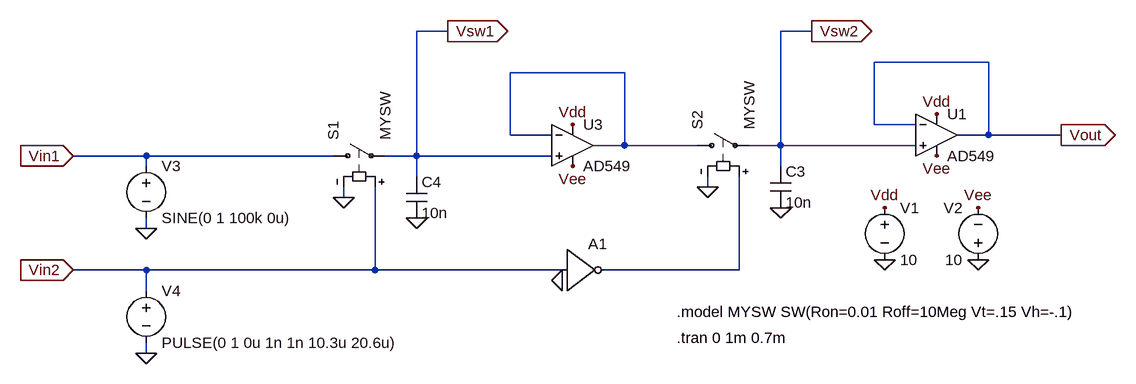
[diagram p0: schematic Sampling Phase Detector.asc]
Sampling Phase Detector.asc, the LTspice schematic file:
Version 4
SHEET 1 1824 776
WIRE -576 -80 -624 -80
WIRE -16 -80 -64 -80
WIRE 256 -32 80 -32
WIRE -304 -16 -480 -16
WIRE 80 64 80 -32
WIRE 144 64 80 64
WIRE -480 80 -480 -16
WIRE -416 80 -480 80
WIRE 256 80 256 -32
WIRE 256 80 208 80
WIRE 368 80 256 80
WIRE -304 96 -304 -16
WIRE -304 96 -352 96
WIRE -192 96 -304 96
WIRE -64 96 -64 -80
WIRE -64 96 -112 96
WIRE 144 96 -64 96
WIRE -1040 112 -1152 112
WIRE -752 112 -1040 112
WIRE -624 112 -624 -80
WIRE -624 112 -672 112
WIRE -416 112 -624 112
WIRE -1040 128 -1040 112
WIRE -64 128 -64 96
WIRE -624 144 -624 112
WIRE -176 160 -176 144
WIRE -736 176 -736 160
WIRE -1040 224 -1040 208
WIRE -1040 288 -1152 288
WIRE -688 288 -688 160
WIRE -688 288 -1040 288
WIRE -400 288 -688 288
WIRE -128 288 -128 144
WIRE -128 288 -336 288
WIRE -1040 320 -1040 288
WIRE -1040 416 -1040 400
FLAG -64 192 0
FLAG 368 80 Vout
IOPIN 368 80 Out
FLAG 96 272 0
FLAG 96 192 Vdd
FLAG 240 272 0
FLAG 240 192 Vee
FLAG -624 208 0
FLAG -384 64 Vdd
FLAG -384 128 Vee
FLAG -1040 224 0
FLAG -1040 416 0
FLAG -1152 112 Vin1
IOPIN -1152 112 In
FLAG -1152 288 Vin2
IOPIN -1152 288 In
FLAG -736 176 0
FLAG -176 160 0
FLAG -400 304 0
FLAG 176 48 Vdd
FLAG 176 112 Vee
FLAG -576 -80 Vsw1
IOPIN -576 -80 Out
FLAG -16 -80 Vsw2
IOPIN -16 -80 Out
SYMBOL sw -768 112 R270
SYMATTR InstName S1
SYMATTR Value MYSW
SYMBOL sw -208 96 R270
SYMATTR InstName S2
SYMATTR Value MYSW
SYMBOL cap -80 128 R0
SYMATTR InstName C3
SYMATTR Value 10n
SYMBOL voltage 96 176 R0
WINDOW 123 0 0 Left 0
WINDOW 39 0 0 Left 0
SYMATTR InstName V1
SYMATTR Value 10
SYMBOL voltage 240 288 R180
WINDOW 0 24 96 Left 2
WINDOW 3 24 16 Left 2
WINDOW 123 0 0 Left 0
WINDOW 39 0 0 Left 0
SYMATTR InstName V2
SYMATTR Value 10
SYMBOL cap -640 144 R0
SYMATTR InstName C4
SYMATTR Value 10n
SYMBOL voltage -1040 112 R0
WINDOW 123 0 0 Left 0
WINDOW 39 0 0 Left 0
SYMATTR InstName V3
SYMATTR Value SINE(0 1 100k 0u)
SYMBOL voltage -1040 304 R0
WINDOW 123 0 0 Left 0
WINDOW 39 0 0 Left 0
SYMATTR InstName V4
SYMATTR Value PULSE(0 1 0u 1n 1n 10.3u 20.6u)
SYMBOL Digital\\inv -400 224 R0
SYMATTR InstName A1
SYMBOL Opamps\\AD549 -384 32 R0
SYMATTR InstName U3
SYMBOL Opamps\\AD549 176 16 R0
SYMATTR InstName U1
TEXT -224 392 Left 2 !.tran 0 1m 0.7m
TEXT -224 352 Left 2 !.model MYSW SW(Ron=0.01 Roff=10Meg Vt=.15 Vh=-.1)

The netlist it stands for:
* Sampling Phase Detector.asc
S1 Vin1 Vsw1 Vin2 0 MYSW
S2 N001 Vsw2 N002 0 MYSW
C3 Vsw2 0 10n
V1 Vdd 0 10
V2 0 Vee 10
C4 Vsw1 0 10n
V3 Vin1 0 SINE(0 1 100k 0u)
V4 Vin2 0 PULSE(0 1 0u 1n 1n 10.3u 20.6u)
A1 Vin2 0 0 0 0 N002 0 0 BUF
XU3 Vsw1 N001 Vdd Vee N001 AD549  ; pins In+ In- V+ V- OUT
XU1 Vsw2 Vout Vdd Vee Vout AD549  ; pins In+ In- V+ V- OUT
.tran 0 1m 0.7m
.model MYSW SW(Ron=0.01 Roff=10Meg Vt=.15 Vh=-.1)
.backanno
.end